# Altium project TIDA-010086_mod.PrjPcb (part 2 of 11)

## Sheet XTIDA-010086_Power Stage.SchDoc: Power Stage
size 558 x 431 mm; Date: Not shown in title block; ApprovedBy: Not shown in title block; CheckedBy: Not shown in title block; Author: Not shown in title block; CompanyName: Not shown in title block; DrawnBy: Jeff Xie; Engineer: Not shown in title block; Organization: Not shown in title block; Address1: Not shown in title block; Address2: Not shown in title block; Address3: Not shown in title block; Address4: Not shown in title block; DocumentNumber: 2; Revision: Use project parameter SCH_Rev; SheetNumber: 4; SheetTotal: 8; PageSetup: Record=PageOptions|CenterHorizontal=True|CenterVertical=True|PrintScale=1.00|XCorrection=1.00|YCorrection=1.00|PrintKind=0|BorderSize=5000000|LeftOffset=0|BottomOffset=0|Orientation=2|PaperLength=1000|PaperWidth=1000|Scale=100|PaperSource=15|PrintQuality=600|MediaType=1|DitherType=10|PaperKind=Letter|PrintScaleMode=1; CurrentTime: Not shown in title block; CurrentDate: Not shown in title block; Time: Not shown in title block; DocumentFullPathAndName: Not shown in title block; DocumentName: Not shown in title block; ModifiedDate: Not shown in title block; ImagePath: Not shown in title block
Used 8 times, as channels MAIN SHEET/Ch1, MAIN SHEET/Ch2, MAIN SHEET/Ch3, MAIN SHEET/Ch4, MAIN SHEET/Ch5, MAIN SHEET/Ch6, MAIN SHEET/Ch7, MAIN SHEET/Ch8. Parts and nets are listed once, with the designators drawn on the sheet.
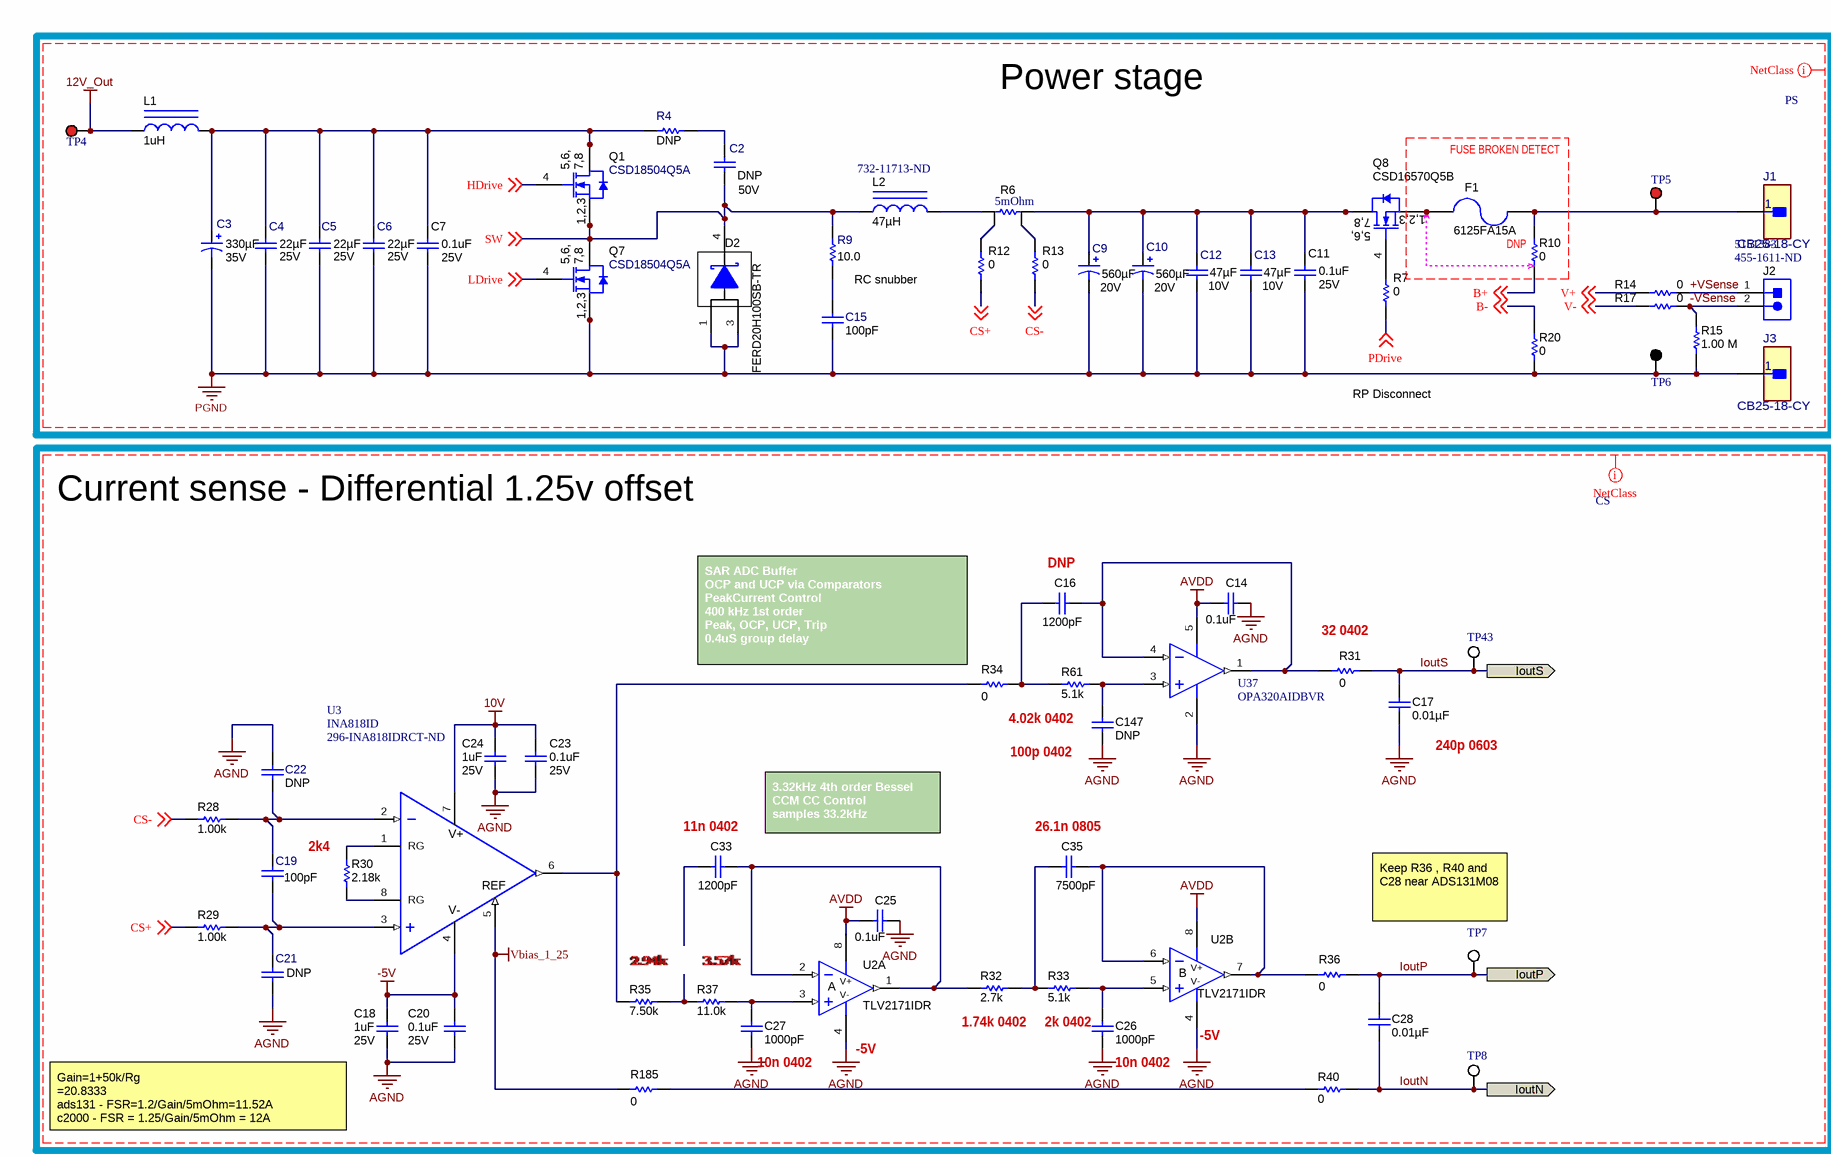
[diagram p5: XTIDA-010086_Power Stage.SchDoc, top left]
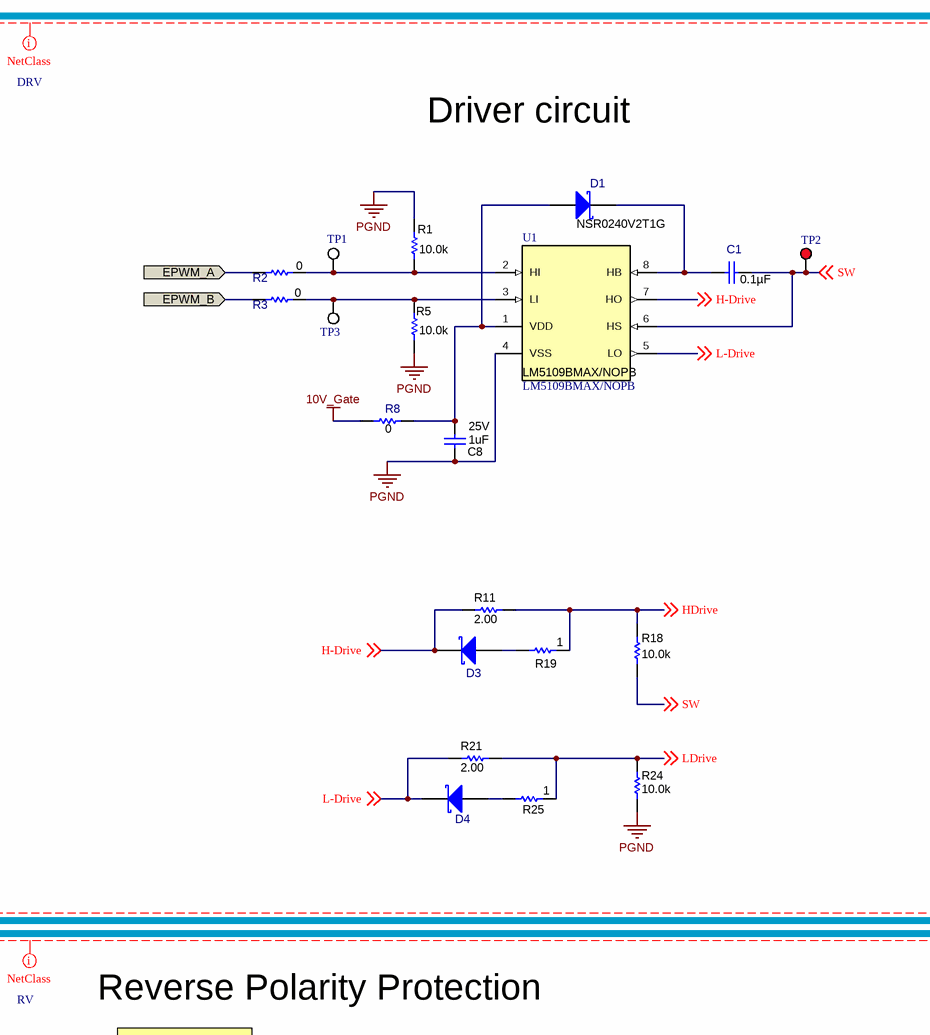
[diagram p6: XTIDA-010086_Power Stage.SchDoc, top right]
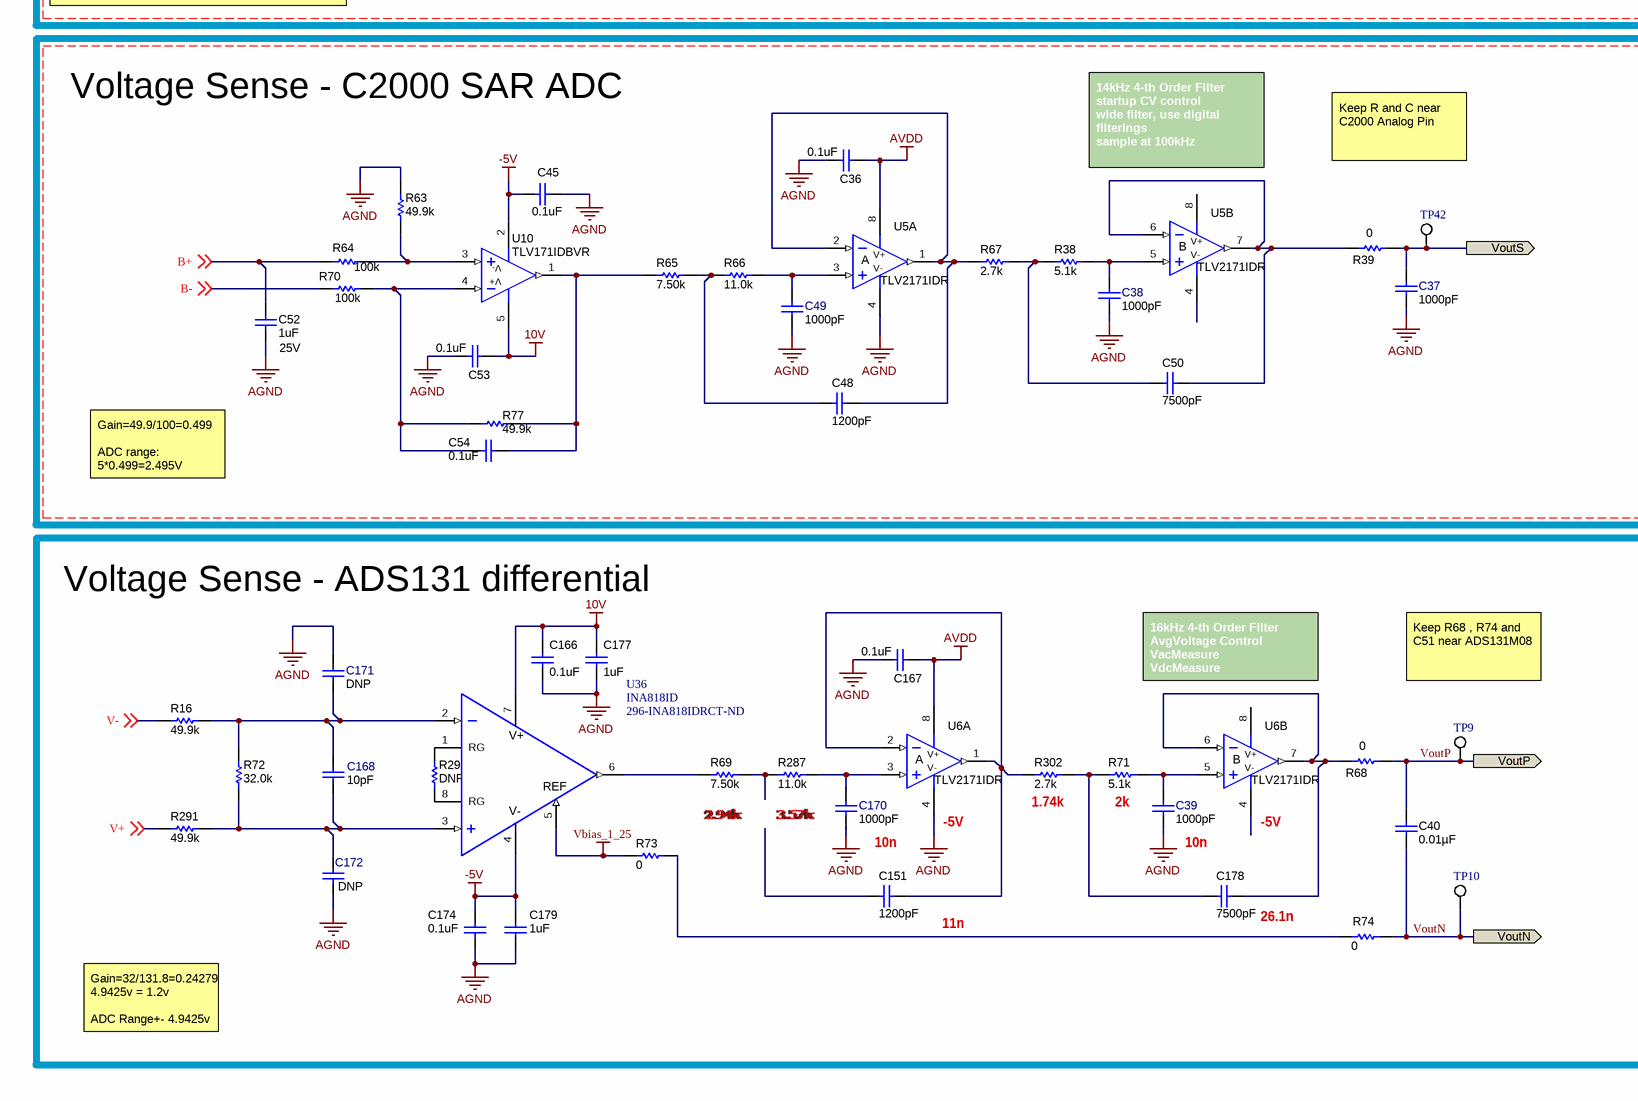
[diagram p7: XTIDA-010086_Power Stage.SchDoc, bottom left]
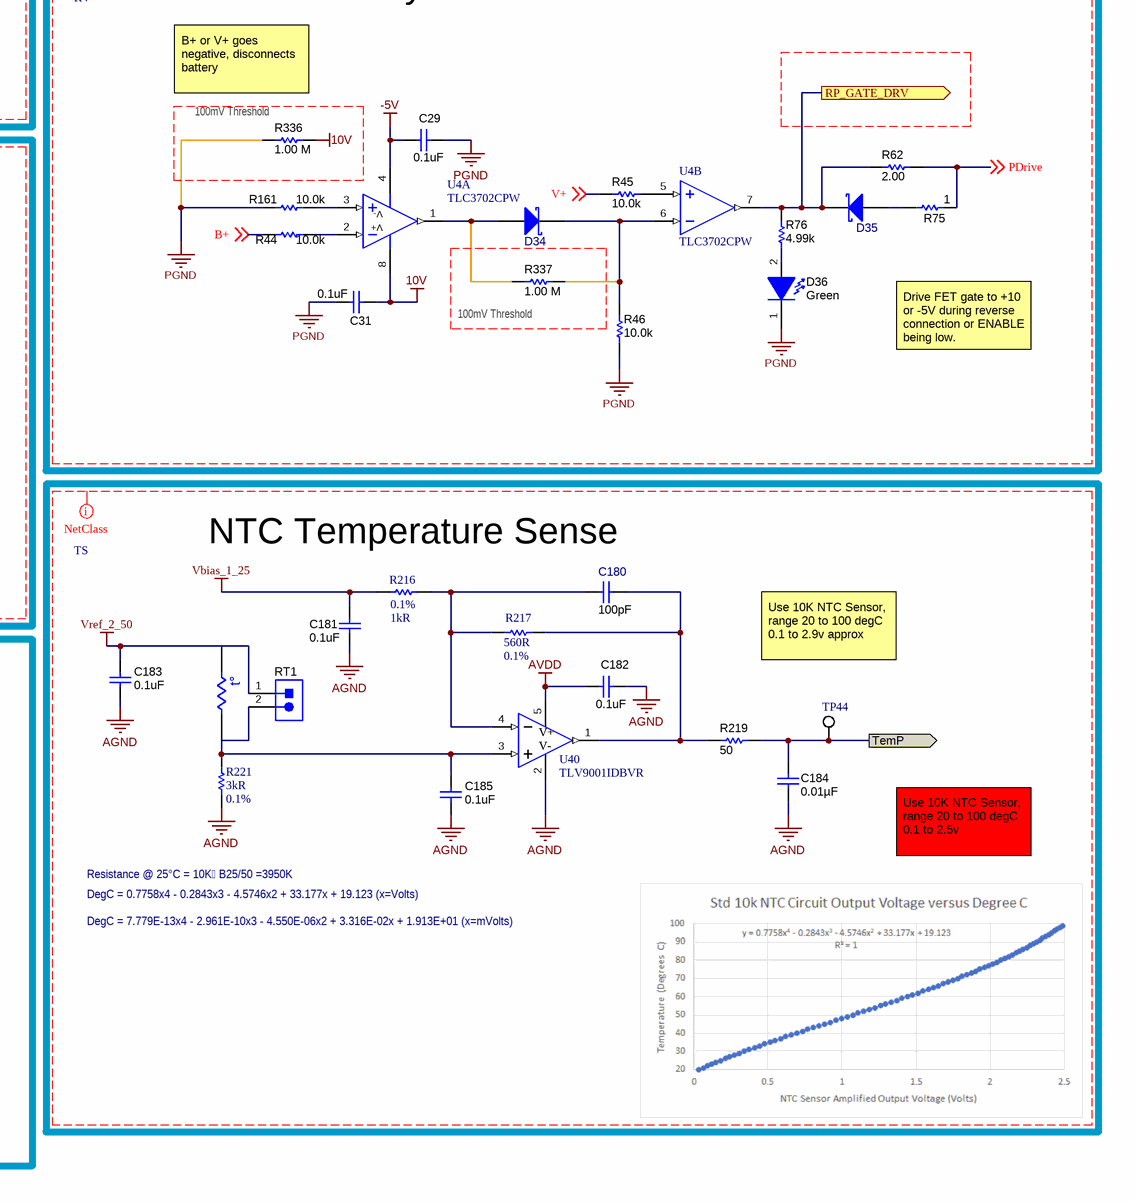
[diagram p8: XTIDA-010086_Power Stage.SchDoc, bottom right]

### Parts
(Parts that share a designator on the sheet are numbered #1, #2 ... from top to bottom, then left to right.)
C1  ValueDisplayed: 0.1µF  [0603L]  (hidden comment: C0603C104J3RACTU)
C2  ValueDisplayed: DNP  Value2: 50V  [0603L]  (hidden comment: GRM1885C1H101JA01D)
C3  ValueDisplayed: 330µF  Value2: 35V  [CAPSMT_62_F12]  (hidden comment: 35SVPK330M)
C4  ValueDisplayed: 22µF  Value2: 25V  [1210_270]  (hidden comment: GRM32ER71E226KE15L)
C5  ValueDisplayed: 22µF  Value2: 25V  [1210_270]  (hidden comment: GRM32ER71E226KE15L)
C6  ValueDisplayed: 22µF  Value2: 25V  [1210_270]  (hidden comment: GRM32ER71E226KE15L)
C7  ValueDisplayed: 0.1uF  Value2: 25V  [0603]  (hidden comment: 06033C104JAT2A)
C8  ValueDisplayed: 1uF  VDC_V: 25V  [0603]  (hidden comment: GRM188R71E105KA12D)
C9  ValueDisplayed: 560µF  Value2: 20V  [SM_RADIAL_10AMM]  (hidden comment: 20SVF560M)
C10  ValueDisplayed: 560µF  Value2: 20V  [SM_RADIAL_10AMM]  (hidden comment: 20SVF560M)
C11  ValueDisplayed: 0.1uF  Value2: 25V  [0603]  (hidden comment: 06033C104JAT2A)
C12  ValueDisplayed: 47µF  Value2: 10V  [1210_270]  (hidden comment: GRM32ER71A476ME15L)
C13  ValueDisplayed: 47µF  Value2: 10V  [1210_270]  (hidden comment: GRM32ER71A476ME15L)
C14  ValueDisplayed: 0.1uF  [0603]  (hidden comment: 06033C104JAT2A)
C15  ValueDisplayed: 100pF  [0603L]  (hidden comment: GRM1885C1H101JA01D)
C16  ValueDisplayed: 1200pF  [0402]  (hidden comment: GRM155R71H122KA01D)
C17  ValueDisplayed: 0.01µF  [0603]  (hidden comment: C0603C103J3GECAUTO)
C18  ValueDisplayed: 1uF  VDC_V: 25V  [0603]  (hidden comment: GRM188R71E105KA12D)
C19  ValueDisplayed: 100pF  [0603L]  (hidden comment: GRM1885C1H101JA01D)
C20  ValueDisplayed: 0.1uF  Value2: 25V  [0603]  (hidden comment: 06033C104JAT2A)
C21  value DNP  [0603L]  (hidden comment: GRM1885C1H101JA01D)
C22  value DNP  [0603L]  (hidden comment: GRM1885C1H101JA01D)
C23  ValueDisplayed: 0.1uF  Value2: 25V  [0603]  (hidden comment: 06033C104JAT2A)
C24  ValueDisplayed: 1uF  Value2: 25V  [0603]  (hidden comment: GRM188R71E105KA12D)
C25  ValueDisplayed: 0.1uF  [0603]  (hidden comment: 06033C104JAT2A)
C26  ValueDisplayed: 1000pF  [0402]  (hidden comment: 885012205044)
C27  ValueDisplayed: 1000pF  [0402]  (hidden comment: 885012205044)
C28  ValueDisplayed: 0.01µF  [0603]  (hidden comment: C0603C103J3GECAUTO)
C29  ValueDisplayed: 0.1uF  [0603]  (hidden comment: 06033C104JAT2A)
C31  ValueDisplayed: 0.1uF  [0603]  (hidden comment: 06033C104JAT2A)
C33  ValueDisplayed: 1200pF  [0402]  (hidden comment: GRM155R71H122KA01D)
C35  ValueDisplayed: 7500pF  [0805_HV]  (hidden comment: GRM2195C1H752JA01D)
C36  ValueDisplayed: 0.1uF  [0603]  (hidden comment: 06033C104JAT2A)
C37  ValueDisplayed: 1000pF  [0603L]  (hidden comment: GRM1885C1H102JA01D)
C38  ValueDisplayed: 1000pF  [0603L]  (hidden comment: GRM1885C1H102JA01D)
C39  ValueDisplayed: 1000pF  [0603L]  (hidden comment: GRM1885C1H102JA01D)
C40  ValueDisplayed: 0.01µF  [0603]  (hidden comment: C0603C103J3GECAUTO)
C45  ValueDisplayed: 0.1uF  [0603]  (hidden comment: 06033C104JAT2A)
C48  ValueDisplayed: 1200pF  [0402]  (hidden comment: GRM155R71H122KA01D)
C49  ValueDisplayed: 1000pF  [0603L]  (hidden comment: GRM1885C1H102JA01D)
C50  ValueDisplayed: 7500pF  [0805_HV]  (hidden comment: GRM2195C1H752JA01D)
C52  ValueDisplayed: 1uF  Value2: 25V  [0603]  (hidden comment: GRM188R71E105KA12D)
C53  ValueDisplayed: 0.1uF  [0603]  (hidden comment: 06033C104JAT2A)
C54  value 0.1uF  [0603]  (hidden comment: 06033C104JAT2A)
C147  ValueDisplayed: DNP  [0402]  (hidden comment: GRM155R71H122KA01D)
C151  ValueDisplayed: 1200pF  [0402]  (hidden comment: GRM155R71H122KA01D)
C166  ValueDisplayed: 0.1uF  [0603]  (hidden comment: 06033C104JAT2A)
C167  ValueDisplayed: 0.1uF  [0603]  (hidden comment: 06033C104JAT2A)
C168  ValueDisplayed: 10pF  [0603L]  (hidden comment: GRM1885C1H100JA01D)
C170  ValueDisplayed: 1000pF  [0603L]  (hidden comment: GRM1885C1H102JA01D)
C171  value DNP  [0603L]  (hidden comment: GRM1885C1H101JA01D)
C172  value DNP  [0603L]  (hidden comment: GRM1885C1H101JA01D)
C174  ValueDisplayed: 0.1uF  [0603]  (hidden comment: 06033C104JAT2A)
C177  ValueDisplayed: 1uF  [0603]  (hidden comment: GRM188R71E105KA12D)
C178  ValueDisplayed: 7500pF  [0805_HV]  (hidden comment: GRM2195C1H752JA01D)
C179  ValueDisplayed: 1uF  [0603]  (hidden comment: GRM188R71E105KA12D)
C180  ValueDisplayed: 100pF  [0603L]  (hidden comment: GRM1885C1H101JA01D)
C181  ValueDisplayed: 0.1uF  [0603]  (hidden comment: 06033C104JAT2A)
C182  ValueDisplayed: 0.1uF  [0603]  (hidden comment: 06033C104JAT2A)
C183  ValueDisplayed: 0.1uF  [0603]  (hidden comment: 06033C104JAT2A)
C184  ValueDisplayed: 0.01µF  [0603]  (hidden comment: C0603C103J3GECAUTO)
C185  ValueDisplayed: 0.1uF  [0603]  (hidden comment: 06033C104JAT2A)
D1  NSR0240V2T1G  [SOD-523]
D2  FERD20H100SB-TR  [DPAK]
D3  NSR0240V2T1G  [SOD-523]  (value not drawn)
D4  NSR0240V2T1G  [SOD-523]  (value not drawn)
D34  NSR0240V2T1G  [SOD-523]  (value not drawn)
D35  NSR0240V2T1G  [SOD-523]  (value not drawn)
D36  value Green  [WL-SMCW_GREEN]  (hidden comment: 150060VS75000)
F1  6125FA15A  [6125FA]
J1  CB25-18-CY  [FP-CB25-18-CY_CONN_TERM_LUG_25MM4_7MM9-MFG]
J2  Supplier Part Number 1: 455-1611-ND  Supplier Part Number 2: 5151383  [JST_B2B-EH-A]  (hidden comment: B2B-EH-A(LF)(SN))
J3  CB25-18-CY  [FP-CB25-18-CY_CONN_TERM_LUG_25MM4_7MM9-MFG]
L1  ValueDisplayed: 1uH  [WE-LHMI_4020]  (hidden comment: 74437324010)
L2  ValueDisplayed: 47µH  Supplier Part Number 1: 732-11713-ND  [WE-HCF Round_2920]  (hidden comment: 74437529203470)
Q1  CSD18504Q5A  [DQJ0008A]
Q7  CSD18504Q5A  [DQJ0008A]
Q8  CSD16570Q5B  [DNK0008A]
R1  ValueDisplayed: 10.0k  [0603]  (hidden comment: RC0603FR-0710KL)
R2  ValueDisplayed: 0  [0603L]  (hidden comment: RC0603JR-070RL)
R3  ValueDisplayed: 0  [0603L]  (hidden comment: RC0603JR-070RL)
R4  ValueDisplayed: DNP  [1206L]  (hidden comment: RC1206FR-0710RL)
R5  ValueDisplayed: 10.0k  [0603]  (hidden comment: RC0603FR-0710KL)
R6  ValueDisplayed: 5mOhm  [CSM3637Z]  (hidden comment: Y14880R00500B9R)
R7  ValueDisplayed: 0  [0402]  (hidden comment: CRCW04020000Z0ED)
R8  ValueDisplayed: 0  [0603L]  (hidden comment: RC0603JR-070RL)
R9  ValueDisplayed: 10.0  [1206L]  (hidden comment: RC1206FR-0710RL)
R10  ValueDisplayed: 0  [0402]  (hidden comment: CRCW04020000Z0ED)
R11  ValueDisplayed: 2.00  [0603]  (hidden comment: CRCW06032R00FKEA)
R12  ValueDisplayed: 0  [0402]  (hidden comment: CRCW04020000Z0ED)
R13  ValueDisplayed: 0  [0402]  (hidden comment: CRCW04020000Z0ED)
R14  ValueDisplayed: 0  [0402]  (hidden comment: CRCW04020000Z0ED)
R15  ValueDisplayed: 1.00 M  [0603]  (hidden comment: CRCW06031M00FKEA)
R16  ValueDisplayed: 49.9k  [0603]  (hidden comment: CRCW060349K9FKEA)
R17  ValueDisplayed: 0  [0402]  (hidden comment: CRCW04020000Z0ED)
R18  ValueDisplayed: 10.0k  [0603]  (hidden comment: RC0603FR-0710KL)
R19  ValueDisplayed: 1  [0603]  (hidden comment: RC0603FR-071RL)
R20  ValueDisplayed: 0  [0402]  (hidden comment: CRCW04020000Z0ED)
R21  ValueDisplayed: 2.00  [0603]  (hidden comment: CRCW06032R00FKEA)
R24  ValueDisplayed: 10.0k  [0603]  (hidden comment: RC0603FR-0710KL)
R25  ValueDisplayed: 1  [0603]  (hidden comment: RC0603FR-071RL)
R28  ValueDisplayed: 1.00k  [0603]  (hidden comment: RG1608P-102-B-T5)
R29  ValueDisplayed: 1.00k  [0603]  (hidden comment: RG1608P-102-B-T5)
R30  ValueDisplayed: 2.18k  [0603]  (hidden comment: RT0603BRD072K18L)
R31  ValueDisplayed: 0  [0402]  (hidden comment: CRCW04020000Z0ED)
R32  ValueDisplayed: 2.7k  [0402]  (hidden comment: CRCW04022K70JNED)
R33  ValueDisplayed: 5.1k  [0402]  (hidden comment: CRCW04025K10JNED)
R34  ValueDisplayed: 0  [0402]  (hidden comment: CRCW04020000Z0ED)
R35  ValueDisplayed: 7.50k  [0402]  (hidden comment: CRCW04027K50FKED)
R36  ValueDisplayed: 0  [0402]  (hidden comment: CRCW04020000Z0ED)
R37  ValueDisplayed: 11.0k  [0402]  (hidden comment: CRCW040211K0FKED)
R38  ValueDisplayed: 5.1k  [0402]  (hidden comment: CRCW04025K10JNED)
R39  ValueDisplayed: 0  [0402]  (hidden comment: CRCW04020000Z0ED)
R40  ValueDisplayed: 0  [0402]  (hidden comment: CRCW04020000Z0ED)
R44  ValueDisplayed: 10.0k  [0603]  (hidden comment: RC0603FR-0710KL)
R45  ValueDisplayed: 10.0k  [0603]  (hidden comment: RC0603FR-0710KL)
R46  ValueDisplayed: 10.0k  [0603]  (hidden comment: RC0603FR-0710KL)
R61  ValueDisplayed: 5.1k  [0402]  (hidden comment: CRCW04025K10JNED)
R62  ValueDisplayed: 2.00  [0603]  (hidden comment: CRCW06032R00FKEA)
R63  ValueDisplayed: 49.9k  [0603]  (hidden comment: CRCW060349K9FKEA)
R64  ValueDisplayed: 100k  [0603]  (hidden comment: RT0603BRD07100KL)
R65  ValueDisplayed: 7.50k  [0402]  (hidden comment: CRCW04027K50FKED)
R66  ValueDisplayed: 11.0k  [0402]  (hidden comment: CRCW040211K0FKED)
R67  ValueDisplayed: 2.7k  [0402]  (hidden comment: CRCW04022K70JNED)
R68  ValueDisplayed: 0  [0402]  (hidden comment: CRCW04020000Z0ED)
R69  ValueDisplayed: 7.50k  [0402]  (hidden comment: CRCW04027K50FKED)
R70  ValueDisplayed: 100k  [0603]  (hidden comment: RT0603BRD07100KL)
R71  ValueDisplayed: 5.1k  [0402]  (hidden comment: CRCW04025K10JNED)
R72  ValueDisplayed: 32.0k  [0603]  (hidden comment: RN731JTTD3202B25)
R73  ValueDisplayed: 0  [0402]  (hidden comment: CRCW04020000Z0ED)
R74  ValueDisplayed: 0  [0402]  (hidden comment: CRCW04020000Z0ED)
R75  ValueDisplayed: 1  [0603]  (hidden comment: RC0603FR-071RL)
R76  ValueDisplayed: 4.99k  [0603L]  (hidden comment: CRCW06034K99FKEA)
R77  ValueDisplayed: 49.9k  [0603]  (hidden comment: CRCW060349K9FKEA)
R161  ValueDisplayed: 10.0k  [0603]  (hidden comment: RC0603FR-0710KL)
R185  ValueDisplayed: 0  [0402]  (hidden comment: CRCW04020000Z0ED)
R216  Tolerance: 0.1%  Resistance: 1kR  [RESC1608X55X25ML10T15]  (hidden comment: RT0603BRE071KL)
R217  Resistance: 560R  Tolerance: 0.1%  [RESC1608X55X25LL10T15]  (hidden comment: RT0603BRD07560RL)
R219  ValueDisplayed: 50  [0402]  (hidden comment: FC0402E50R0BST1)
R221  Resistance: 3kR  Tolerance: 0.1%  [RESC1608X55X30NL20T20]  (hidden comment: ERA-3YEB302V)
R287  ValueDisplayed: 11.0k  [0402]  (hidden comment: CRCW040211K0FKED)
R290  ValueDisplayed: DNP  [0402]  (hidden comment: CRCW04020000Z0ED)
R291  ValueDisplayed: 49.9k  [0603]  (hidden comment: CRCW060349K9FKEA)
R302  ValueDisplayed: 2.7k  [0402]  (hidden comment: CRCW04022K70JNED)
R336  ValueDisplayed: 1.00 M  [0603]  (hidden comment: CRCW06031M00FKEA)
R337  ValueDisplayed: 1.00 M  [0603]  (hidden comment: CRCW06031M00FKEA)
RT1#1  B2B-EH-A(LF)(SN)  [JST_B2B-EH-A]  (value not drawn)
RT1#2  Res Thermal  [JST_B2B-EH-A]  (value not drawn)  (graphical)
TP1  5002  [Keystone5002]  (value not drawn)
TP2  5000  [Keystone5000]  (value not drawn)
TP3  5002  [Keystone5002]  (value not drawn)
TP4  5000  [Keystone5000]  (value not drawn)
TP5  5000  [Keystone5000]  (value not drawn)
TP6  5001  [Keystone5001]  (value not drawn)
TP7  5002  [Keystone5002]  (value not drawn)
TP8  5002  [Keystone5002]  (value not drawn)
TP9  5002  [Keystone5002]  (value not drawn)
TP10  5002  [Keystone5002]  (value not drawn)
TP42  5002  [Keystone5002]  (value not drawn)
TP43  5002  [Keystone5002]  (value not drawn)
TP44  5002  [Keystone5002]  (value not drawn)
U1  LM5109BMAX/NOPB  [D0008A_N]
U2  TLV2171IDR  [D0008A_N]  (parts A,B of 2)
U3  INA818ID  Supplier Part Number 1: 296-INA818IDRCT-ND  [SOIC-8_TEX]
U4  TLC3702CPW  [PW8-L]  (parts A,B of 2)
U5  TLV2171IDR  [D0008A_N]  (parts A,B of 2)
U6  TLV2171IDR  [D0008A_N]  (parts A,B of 2)
U10  TLV171IDBVR  [DBV0005A_N]
U36  INA818ID  Supplier Part Number 1: 296-INA818IDRCT-ND  [SOIC-8_TEX]
U37  OPA320AIDBVR  [DBV0005A_L]
U40  TLV9001IDBVR  [DBV0005A_L]

### Blocks framed on the sheet
Power stage: C2-C7 C9-C13 C15 D2 F1 J1-J3 L1 L2 Q1 Q7 Q8 R4 R6 R7 R9 R10 R12-R15 R17 R20 TP4-TP6
Driver circuit: C1 C8 D1 D3 D4 R1-R3 R5 R8 R11 R18 R19 R21 R24 R25 TP1-TP3 U1
Current sense - Differential 1.25v offset: C14 C16-C28 C33 C35 C147 R28-R37 R40 R61 R185 TP7 TP8 TP43 U2 U3 U37
Reverse Polarity Protection: C29 C31 D34-D36 R44-R46 R62 R75 R76 R161 R336 R337 U4
Voltage Sense - C2000 SAR ADC: C36-C38 C45 C48-C50 C52-C54 R38 R39 R63-R67 R70 R77 TP42 U5 U10
NTC Temperature Sense: C180-C185 R216 R217 R219 R221 RT1#1 RT1#2 TP44 U40
Voltage Sense - ADS131 differential: C39 C40 C151 C166-C168 C170-C172 C174 C177-C179 R16 R68 R69 R71-R74 R287 R290 R291 R302 TP9 TP10 U6 U36

### Ports
EPWM_A (in), EPWM_B (in), IoutN (out), IoutP (out), IoutS (out), RP_GATE_DRV (out), TemP (out), VoutN (out), VoutP (out), VoutS (out)

### Nets
10V: C23.1 C24.1 C31.1 C53.1 C166.1 C177.1 R336.2 U3.7(V+) U4.8(VDD) U10.5(V+) U36.7(V+)
10V_Gate: R8.2
12V_Out: L1.1 TP4.1
-5V: C18.1 C20.1 C29.1 C45.1 C174.1 C179.1 U3.4(V-) U4.4(GND) U10.2(V-) U36.4(V-)
AGND: C14.2 C17.2 C18.2 C20.2 C21.1 C22.2 C23.2 C24.2 C25.2 C26.2 C27.2 C36.2 C37.1 C38.1 C39.1 C45.2 C49.1 C52.2 C53.2 C147.2 C166.2 C167.2 C170.1 C171.2 C172.2 C174.2 C177.2 C179.2 C181.1 C182.2 C183.1 C184.2 C185.1 R63.2 R221.1 U2.4(V-) U5.4(V-) U6.4(V-) U37.2(V-) U40.2(V-)
AVDD: C14.1 C25.1 C36.1 C167.1 C182.1 U2.8(V+) U5.8(V+) U6.8(V+) U37.5(V+) U40.5(V+)
PGND: C3.2(-) C4.2 C5.2 C6.2 C7.2 C8.1 C9.2(-) C10.2(-) C11.2 C12.2 C13.2 C15.1 C29.2 C31.2 D2.1(A) D2.3(A) D36.1(K) J3.1 Q7.1(S) Q7.2(S) Q7.3(S) R1.2 R5.1 R15.2 R20.1 R24.1 R46.2 R161.2 R336.1 TP6.1 U1.4(VSS)
Vbias_1_25: C181.2 R73.2 R185.2 R216.1 U3.5(REF) U36.5(REF)
Vref_2_50: C183.2 RT1#1.1 RT1#2.1
+VSense: J2.1 R14.2
-VSense: J2.2 R15.1 R17.2
B+: C52.1 R10.1 R44.2 R64.1 ; off-sheet B+
B-: R20.2 R70.1 ; off-sheet B-
CS+: R12.1 R29.1 ; off-sheet CS+
CS-: R13.1 R28.1 ; off-sheet CS-
EPWM_A: R2.2 ; port EPWM_A
EPWM_B: R3.2 ; port EPWM_B
H-Drive: D3.1(K) R11.2 U1.7(HO) ; off-sheet H-Drive
HDrive: Q1.4(G) R11.1 R18.2 R19.2 ; off-sheet HDrive
IoutN: C28.2 R40.1 TP8.1 ; port IoutN
IoutP: C28.1 R36.2 TP7.1 ; port IoutP
IoutS: C17.1 R31.2 TP43.1 ; port IoutS
L-Drive: D4.1(K) R21.2 U1.5(LO) ; off-sheet L-Drive
LDrive: Q7.4(G) R21.1 R24.2 R25.2 ; off-sheet LDrive
PDrive: R7.1 R62.1 R75.2 ; off-sheet PDrive
RP_GATE_DRV: D35.1(K) R62.2 R76.1 U4.7(2OUT) ; port RP_GATE_DRV
SW: C1.2 C2.1 D2.4(K) L2.1 Q1.1(S) Q1.2(S) Q1.3(S) Q7.5(D) Q7.6(D) Q7.7(D) Q7.8(D) Q7.9(D) R9.1 R18.1 TP2.1 U1.6(HS) ; off-sheet SW
TemP: C184.1 R219.2 TP44.1 ; port TemP
V+: R14.1 R45.2 R291.2 ; off-sheet V+
V-: R16.2 R17.1 ; off-sheet V-
VoutN: C40.2 R74.1 TP10.1 ; port VoutN
VoutP: C40.1 R68.2 TP9.1 ; port VoutP
VoutS: C37.2 R39.2 TP42.1 ; port VoutS
NetC1_1: C1.1 D1.1(K) U1.8(HB)
NetC2_2: C2.2 R4.2
NetC3_1: C3.1(+) C4.1 C5.1 C6.1 C7.1 L1.2 Q1.5(D) Q1.6(D) Q1.7(D) Q1.8(D) Q1.9(D) R4.1
NetC8_2: C8.2 D1.2(A) R8.1 U1.1(VDD)
NetC9_1: C9.1(+) C10.1(+) C11.1 C12.1 C13.1 Q8.5(D) Q8.6(D) Q8.7(D) Q8.8(D) Q8.9(D) R6.1
NetC15_2: C15.2 R9.2
NetC16_1: C16.1 R31.1 U37.1(OUT) U37.4(IN-)
NetC16_2: C16.2 R34.2 R61.1
NetC19_1: C19.1 C22.1 R28.2 U3.2(IN-)
NetC19_2: C19.2 C21.2 R29.2 U3.3(IN+)
NetC26_1: C26.1 R33.2 U2.5(IN+)
NetC27_1: C27.1 R37.2 U2.3(IN+)
NetC33_1: C33.1 R32.1 U2.1(OUT) U2.2(IN-)
NetC33_2: C33.2 R35.2 R37.1
NetC35_1: C35.1 R36.1 U2.6(IN-) U2.7(OUT)
NetC35_2: C35.2 R32.2 R33.1
NetC38_2: C38.2 R38.2 U5.5(IN+)
NetC39_2: C39.2 R71.2 U6.5(IN+)
NetC48_1: C48.1 R67.1 U5.1(OUT) U5.2(IN-)
NetC48_2: C48.2 R65.2 R66.1
NetC49_2: C49.2 R66.2 U5.3(IN+)
NetC50_1: C50.1 R39.1 U5.6(IN-) U5.7(OUT)
NetC50_2: C50.2 R38.1 R67.2
NetC54_1: C54.1 R70.2 R77.1 U10.4(IN-)
NetC54_2: C54.2 R65.1 R77.2 U10.1(OUT)
NetC147_1: C147.1 R61.2 U37.3(IN+)
NetC151_1: C151.1 R302.1 U6.1(OUT) U6.2(IN-)
NetC151_2: C151.2 R69.2 R287.1
NetC168_1: C168.1 C171.1 R16.1 R72.2 U36.2(IN-)
NetC168_2: C168.2 C172.1 R72.1 R291.1 U36.3(IN+)
NetC170_2: C170.2 R287.2 U6.3(IN+)
NetC178_1: C178.1 R68.1 U6.6(IN-) U6.7(OUT)
NetC178_2: C178.2 R71.1 R302.2
NetC180_1: C180.1 R216.2 R217.1 U40.4(IN-)
NetC180_2: C180.2 R217.2 R219.1 U40.1(OUT)
NetC185_2: C185.2 R221.2 RT1#1.2 RT1#2.2 U40.3(IN+)
NetD3_2: D3.2(A) R19.1
NetD4_2: D4.2(A) R25.1
NetD34_1: D34.1(K) R46.1 R337.2 U4.6(2IN-)
NetD34_2: D34.2(A) R337.1 U4.1(1OUT)
NetD35_2: D35.2(A) R75.1
NetD36_2: D36.2(A) R76.2
NetF1_1: F1.1 J1.1 R10.2 TP5.1
NetF1_2: F1.2 Q8.1(S) Q8.2(S) Q8.3(S)
NetL2_2: L2.2 R6.2
NetQ8_4: Q8.4(G) R7.2
NetR1_1: R1.1 R2.1 TP1.1 U1.2(HI)
NetR3_1: R3.1 R5.2 TP3.1 U1.3(LI)
NetR6_3: R6.3 R13.2
NetR6_4: R6.4 R12.2
NetR30_1: R30.1 U3.8(RG)
NetR30_2: R30.2 U3.1(RG)
NetR34_1: R34.1 R35.1 U3.6(OUT)
NetR40_2: R40.2 R185.1
NetR44_1: R44.1 U4.2(1IN-)
NetR45_1: R45.1 U4.5(2IN+)
NetR63_1: R63.1 R64.2 U10.3(IN+)
NetR69_1: R69.1 U36.6(OUT)
NetR73_1: R73.1 R74.2
NetR161_1: R161.1 U4.3(1IN+)
NetR290_1: R290.1 U36.1(RG)
NetR290_2: R290.2 U36.8(RG)

### Channels
MAIN SHEET/Ch1: designators C1=C1_Ch1 C2=C2_Ch1 C3=C3_Ch1 C4=C4_Ch1 C5=C5_Ch1 C6=C6_Ch1 C7=C7_Ch1 C8=C8_Ch1 C9=C9_Ch1 C10=C10_Ch1 C11=C11_Ch1 C12=C12_Ch1 C13=C13_Ch1 C14=C14_Ch1 C15=C15_Ch1 C16=C16_Ch1 C17=C17_Ch1 C18=C18_Ch1 C19=C19_Ch1 C20=C20_Ch1 C21=C21_Ch1 C22=C22_Ch1 C23=C23_Ch1 C24=C24_Ch1 C25=C25_Ch1 C26=C26_Ch1 C27=C27_Ch1 C28=C28_Ch1 C29=C29_Ch1 C31=C31_Ch1 C33=C33_Ch1 C35=C35_Ch1 C36=C36_Ch1 C37=C37_Ch1 C38=C38_Ch1 C39=C39_Ch1 C40=C40_Ch1 C45=C45_Ch1 C48=C48_Ch1 C49=C49_Ch1 C50=C50_Ch1 C52=C52_Ch1 C53=C53_Ch1 C54=C54_Ch1 C147=C147_Ch1 C151=C151_Ch1 C166=C166_Ch1 C167=C167_Ch1 C168=C168_Ch1 C170=C170_Ch1 C171=C171_Ch1 C172=C172_Ch1 C174=C174_Ch1 C177=C177_Ch1 C178=C178_Ch1 C179=C179_Ch1 C180=C180_Ch1 C181=C181_Ch1 C182=C182_Ch1 C183=C183_Ch1 C184=C184_Ch1 C185=C185_Ch1 D1=D1_Ch1 D2=D2_Ch1 D3=D3_Ch1 D4=D4_Ch1 D34=D34_Ch1 D35=D35_Ch1 D36=D36_Ch1 F1=F1_Ch1 J1=J1_Ch1 J2=J2_Ch1 J3=J3_Ch1 L1=L1_Ch1 L2=L2_Ch1 Q1=Q1_Ch1 Q7=Q7_Ch1 Q8=Q8_Ch1 R1=R1_Ch1 R2=R2_Ch1 R3=R3_Ch1 R4=R4_Ch1 R5=R5_Ch1 R6=R6_Ch1 R7=R7_Ch1 R8=R8_Ch1 R9=R9_Ch1 R10=R10_Ch1 R11=R11_Ch1 R12=R12_Ch1 R13=R13_Ch1 R14=R14_Ch1 R15=R15_Ch1 R16=R16_Ch1 R17=R17_Ch1 R18=R18_Ch1 R19=R19_Ch1 R20=R20_Ch1 R21=R21_Ch1 R24=R24_Ch1 R25=R25_Ch1 R28=R28_Ch1 R29=R29_Ch1 R30=R30_Ch1 R31=R31_Ch1 R32=R32_Ch1 R33=R33_Ch1 R34=R34_Ch1 R35=R35_Ch1 R36=R36_Ch1 R37=R37_Ch1 R38=R38_Ch1 R39=R39_Ch1 R40=R40_Ch1 R44=R44_Ch1 R45=R45_Ch1 R46=R46_Ch1 R61=R61_Ch1 R62=R62_Ch1 R63=R63_Ch1 R64=R64_Ch1 R65=R65_Ch1 R66=R66_Ch1 R67=R67_Ch1 R68=R68_Ch1 R69=R69_Ch1 R70=R70_Ch1 R71=R71_Ch1 R72=R72_Ch1 R73=R73_Ch1 R74=R74_Ch1 R75=R75_Ch1 R76=R76_Ch1 R77=R77_Ch1 R161=R161_Ch1 R185=R185_Ch1 R216=R216_Ch1 R217=R217_Ch1 R219=R219_Ch1 R221=R221_Ch1 R287=R287_Ch1 R290=R290_Ch1 R291=R291_Ch1 R302=R302_Ch1 R336=R336_Ch1 R337=R337_Ch1 RT1=RT1_Ch1#2 RT1=RT1_Ch1#1 TP1=TP1_Ch1 TP2=TP2_Ch1 TP3=TP3_Ch1 TP4=TP4_Ch1 TP5=TP5_Ch1 TP6=TP6_Ch1 TP7=TP7_Ch1 TP8=TP8_Ch1 TP9=TP9_Ch1 TP10=TP10_Ch1 TP42=TP42_Ch1 TP43=TP43_Ch1 TP44=TP44_Ch1 U1=U1_Ch1 U2=U2_Ch1 U3=U3_Ch1 U4=U4_Ch1 U5=U5_Ch1 U6=U6_Ch1 U10=U10_Ch1 U36=U36_Ch1 U37=U37_Ch1 U40=U40_Ch1; ports EPWM_A=EPWM_A EPWM_B=EPWM_B IoutN=IoutN IoutP=IoutP IoutS=IoutS RP_GATE_DRV=RP_GATE_DRV TemP=TemP VoutN=VoutN VoutP=VoutP VoutS=VoutS
MAIN SHEET/Ch2: designators C1=C1_Ch2 C2=C2_Ch2 C3=C3_Ch2 C4=C4_Ch2 C5=C5_Ch2 C6=C6_Ch2 C7=C7_Ch2 C8=C8_Ch2 C9=C9_Ch2 C10=C10_Ch2 C11=C11_Ch2 C12=C12_Ch2 C13=C13_Ch2 C14=C14_Ch2 C15=C15_Ch2 C16=C16_Ch2 C17=C17_Ch2 C18=C18_Ch2 C19=C19_Ch2 C20=C20_Ch2 C21=C21_Ch2 C22=C22_Ch2 C23=C23_Ch2 C24=C24_Ch2 C25=C25_Ch2 C26=C26_Ch2 C27=C27_Ch2 C28=C28_Ch2 C29=C29_Ch2 C31=C31_Ch2 C33=C33_Ch2 C35=C35_Ch2 C36=C36_Ch2 C37=C37_Ch2 C38=C38_Ch2 C39=C39_Ch2 C40=C40_Ch2 C45=C45_Ch2 C48=C48_Ch2 C49=C49_Ch2 C50=C50_Ch2 C52=C52_Ch2 C53=C53_Ch2 C54=C54_Ch2 C147=C147_Ch2 C151=C151_Ch2 C166=C166_Ch2 C167=C167_Ch2 C168=C168_Ch2 C170=C170_Ch2 C171=C171_Ch2 C172=C172_Ch2 C174=C174_Ch2 C177=C177_Ch2 C178=C178_Ch2 C179=C179_Ch2 C180=C180_Ch2 C181=C181_Ch2 C182=C182_Ch2 C183=C183_Ch2 C184=C184_Ch2 C185=C185_Ch2 D1=D1_Ch2 D2=D2_Ch2 D3=D3_Ch2 D4=D4_Ch2 D34=D34_Ch2 D35=D35_Ch2 D36=D36_Ch2 F1=F1_Ch2 J1=J1_Ch2 J2=J2_Ch2 J3=J3_Ch2 L1=L1_Ch2 L2=L2_Ch2 Q1=Q1_Ch2 Q7=Q7_Ch2 Q8=Q8_Ch2 R1=R1_Ch2 R2=R2_Ch2 R3=R3_Ch2 R4=R4_Ch2 R5=R5_Ch2 R6=R6_Ch2 R7=R7_Ch2 R8=R8_Ch2 R9=R9_Ch2 R10=R10_Ch2 R11=R11_Ch2 R12=R12_Ch2 R13=R13_Ch2 R14=R14_Ch2 R15=R15_Ch2 R16=R16_Ch2 R17=R17_Ch2 R18=R18_Ch2 R19=R19_Ch2 R20=R20_Ch2 R21=R21_Ch2 R24=R24_Ch2 R25=R25_Ch2 R28=R28_Ch2 R29=R29_Ch2 R30=R30_Ch2 R31=R31_Ch2 R32=R32_Ch2 R33=R33_Ch2 R34=R34_Ch2 R35=R35_Ch2 R36=R36_Ch2 R37=R37_Ch2 R38=R38_Ch2 R39=R39_Ch2 R40=R40_Ch2 R44=R44_Ch2 R45=R45_Ch2 R46=R46_Ch2 R61=R61_Ch2 R62=R62_Ch2 R63=R63_Ch2 R64=R64_Ch2 R65=R65_Ch2 R66=R66_Ch2 R67=R67_Ch2 R68=R68_Ch2 R69=R69_Ch2 R70=R70_Ch2 R71=R71_Ch2 R72=R72_Ch2 R73=R73_Ch2 R74=R74_Ch2 R75=R75_Ch2 R76=R76_Ch2 R77=R77_Ch2 R161=R161_Ch2 R185=R185_Ch2 R216=R216_Ch2 R217=R217_Ch2 R219=R219_Ch2 R221=R221_Ch2 R287=R287_Ch2 R290=R290_Ch2 R291=R291_Ch2 R302=R302_Ch2 R336=R336_Ch2 R337=R337_Ch2 RT1=RT1_Ch2#2 RT1=RT1_Ch2#1 TP1=TP1_Ch2 TP2=TP2_Ch2 TP3=TP3_Ch2 TP4=TP4_Ch2 TP5=TP5_Ch2 TP6=TP6_Ch2 TP7=TP7_Ch2 TP8=TP8_Ch2 TP9=TP9_Ch2 TP10=TP10_Ch2 TP42=TP42_Ch2 TP43=TP43_Ch2 TP44=TP44_Ch2 U1=U1_Ch2 U2=U2_Ch2 U3=U3_Ch2 U4=U4_Ch2 U5=U5_Ch2 U6=U6_Ch2 U10=U10_Ch2 U36=U36_Ch2 U37=U37_Ch2 U40=U40_Ch2; ports EPWM_A=EPWM_A EPWM_B=EPWM_B IoutN=IoutN IoutP=IoutP IoutS=IoutS RP_GATE_DRV=RP_GATE_DRV TemP=TemP VoutN=VoutN VoutP=VoutP VoutS=VoutS
MAIN SHEET/Ch3: designators C1=C1_Ch3 C2=C2_Ch3 C3=C3_Ch3 C4=C4_Ch3 C5=C5_Ch3 C6=C6_Ch3 C7=C7_Ch3 C8=C8_Ch3 C9=C9_Ch3 C10=C10_Ch3 C11=C11_Ch3 C12=C12_Ch3 C13=C13_Ch3 C14=C14_Ch3 C15=C15_Ch3 C16=C16_Ch3 C17=C17_Ch3 C18=C18_Ch3 C19=C19_Ch3 C20=C20_Ch3 C21=C21_Ch3 C22=C22_Ch3 C23=C23_Ch3 C24=C24_Ch3 C25=C25_Ch3 C26=C26_Ch3 C27=C27_Ch3 C28=C28_Ch3 C29=C29_Ch3 C31=C31_Ch3 C33=C33_Ch3 C35=C35_Ch3 C36=C36_Ch3 C37=C37_Ch3 C38=C38_Ch3 C39=C39_Ch3 C40=C40_Ch3 C45=C45_Ch3 C48=C48_Ch3 C49=C49_Ch3 C50=C50_Ch3 C52=C52_Ch3 C53=C53_Ch3 C54=C54_Ch3 C147=C147_Ch3 C151=C151_Ch3 C166=C166_Ch3 C167=C167_Ch3 C168=C168_Ch3 C170=C170_Ch3 C171=C171_Ch3 C172=C172_Ch3 C174=C174_Ch3 C177=C177_Ch3 C178=C178_Ch3 C179=C179_Ch3 C180=C180_Ch3 C181=C181_Ch3 C182=C182_Ch3 C183=C183_Ch3 C184=C184_Ch3 C185=C185_Ch3 D1=D1_Ch3 D2=D2_Ch3 D3=D3_Ch3 D4=D4_Ch3 D34=D34_Ch3 D35=D35_Ch3 D36=D36_Ch3 F1=F1_Ch3 J1=J1_Ch3 J2=J2_Ch3 J3=J3_Ch3 L1=L1_Ch3 L2=L2_Ch3 Q1=Q1_Ch3 Q7=Q7_Ch3 Q8=Q8_Ch3 R1=R1_Ch3 R2=R2_Ch3 R3=R3_Ch3 R4=R4_Ch3 R5=R5_Ch3 R6=R6_Ch3 R7=R7_Ch3 R8=R8_Ch3 R9=R9_Ch3 R10=R10_Ch3 R11=R11_Ch3 R12=R12_Ch3 R13=R13_Ch3 R14=R14_Ch3 R15=R15_Ch3 R16=R16_Ch3 R17=R17_Ch3 R18=R18_Ch3 R19=R19_Ch3 R20=R20_Ch3 R21=R21_Ch3 R24=R24_Ch3 R25=R25_Ch3 R28=R28_Ch3 R29=R29_Ch3 R30=R30_Ch3 R31=R31_Ch3 R32=R32_Ch3 R33=R33_Ch3 R34=R34_Ch3 R35=R35_Ch3 R36=R36_Ch3 R37=R37_Ch3 R38=R38_Ch3 R39=R39_Ch3 R40=R40_Ch3 R44=R44_Ch3 R45=R45_Ch3 R46=R46_Ch3 R61=R61_Ch3 R62=R62_Ch3 R63=R63_Ch3 R64=R64_Ch3 R65=R65_Ch3 R66=R66_Ch3 R67=R67_Ch3 R68=R68_Ch3 R69=R69_Ch3 R70=R70_Ch3 R71=R71_Ch3 R72=R72_Ch3 R73=R73_Ch3 R74=R74_Ch3 R75=R75_Ch3 R76=R76_Ch3 R77=R77_Ch3 R161=R161_Ch3 R185=R185_Ch3 R216=R216_Ch3 R217=R217_Ch3 R219=R219_Ch3 R221=R221_Ch3 R287=R287_Ch3 R290=R290_Ch3 R291=R291_Ch3 R302=R302_Ch3 R336=R336_Ch3 R337=R337_Ch3 RT1=RT1_Ch3#2 RT1=RT1_Ch3#1 TP1=TP1_Ch3 TP2=TP2_Ch3 TP3=TP3_Ch3 TP4=TP4_Ch3 TP5=TP5_Ch3 TP6=TP6_Ch3 TP7=TP7_Ch3 TP8=TP8_Ch3 TP9=TP9_Ch3 TP10=TP10_Ch3 TP42=TP42_Ch3 TP43=TP43_Ch3 TP44=TP44_Ch3 U1=U1_Ch3 U2=U2_Ch3 U3=U3_Ch3 U4=U4_Ch3 U5=U5_Ch3 U6=U6_Ch3 U10=U10_Ch3 U36=U36_Ch3 U37=U37_Ch3 U40=U40_Ch3; ports EPWM_A=EPWM_A EPWM_B=EPWM_B IoutN=IoutN IoutP=IoutP IoutS=IoutS RP_GATE_DRV=RP_GATE_DRV TemP=TemP VoutN=VoutN VoutP=VoutP VoutS=VoutS
MAIN SHEET/Ch4: designators C1=C1_Ch4 C2=C2_Ch4 C3=C3_Ch4 C4=C4_Ch4 C5=C5_Ch4 C6=C6_Ch4 C7=C7_Ch4 C8=C8_Ch4 C9=C9_Ch4 C10=C10_Ch4 C11=C11_Ch4 C12=C12_Ch4 C13=C13_Ch4 C14=C14_Ch4 C15=C15_Ch4 C16=C16_Ch4 C17=C17_Ch4 C18=C18_Ch4 C19=C19_Ch4 C20=C20_Ch4 C21=C21_Ch4 C22=C22_Ch4 C23=C23_Ch4 C24=C24_Ch4 C25=C25_Ch4 C26=C26_Ch4 C27=C27_Ch4 C28=C28_Ch4 C29=C29_Ch4 C31=C31_Ch4 C33=C33_Ch4 C35=C35_Ch4 C36=C36_Ch4 C37=C37_Ch4 C38=C38_Ch4 C39=C39_Ch4 C40=C40_Ch4 C45=C45_Ch4 C48=C48_Ch4 C49=C49_Ch4 C50=C50_Ch4 C52=C52_Ch4 C53=C53_Ch4 C54=C54_Ch4 C147=C147_Ch4 C151=C151_Ch4 C166=C166_Ch4 C167=C167_Ch4 C168=C168_Ch4 C170=C170_Ch4 C171=C171_Ch4 C172=C172_Ch4 C174=C174_Ch4 C177=C177_Ch4 C178=C178_Ch4 C179=C179_Ch4 C180=C180_Ch4 C181=C181_Ch4 C182=C182_Ch4 C183=C183_Ch4 C184=C184_Ch4 C185=C185_Ch4 D1=D1_Ch4 D2=D2_Ch4 D3=D3_Ch4 D4=D4_Ch4 D34=D34_Ch4 D35=D35_Ch4 D36=D36_Ch4 F1=F1_Ch4 J1=J1_Ch4 J2=J2_Ch4 J3=J3_Ch4 L1=L1_Ch4 L2=L2_Ch4 Q1=Q1_Ch4 Q7=Q7_Ch4 Q8=Q8_Ch4 R1=R1_Ch4 R2=R2_Ch4 R3=R3_Ch4 R4=R4_Ch4 R5=R5_Ch4 R6=R6_Ch4 R7=R7_Ch4 R8=R8_Ch4 R9=R9_Ch4 R10=R10_Ch4 R11=R11_Ch4 R12=R12_Ch4 R13=R13_Ch4 R14=R14_Ch4 R15=R15_Ch4 R16=R16_Ch4 R17=R17_Ch4 R18=R18_Ch4 R19=R19_Ch4 R20=R20_Ch4 R21=R21_Ch4 R24=R24_Ch4 R25=R25_Ch4 R28=R28_Ch4 R29=R29_Ch4 R30=R30_Ch4 R31=R31_Ch4 R32=R32_Ch4 R33=R33_Ch4 R34=R34_Ch4 R35=R35_Ch4 R36=R36_Ch4 R37=R37_Ch4 R38=R38_Ch4 R39=R39_Ch4 R40=R40_Ch4 R44=R44_Ch4 R45=R45_Ch4 R46=R46_Ch4 R61=R61_Ch4 R62=R62_Ch4 R63=R63_Ch4 R64=R64_Ch4 R65=R65_Ch4 R66=R66_Ch4 R67=R67_Ch4 R68=R68_Ch4 R69=R69_Ch4 R70=R70_Ch4 R71=R71_Ch4 R72=R72_Ch4 R73=R73_Ch4 R74=R74_Ch4 R75=R75_Ch4 R76=R76_Ch4 R77=R77_Ch4 R161=R161_Ch4 R185=R185_Ch4 R216=R216_Ch4 R217=R217_Ch4 R219=R219_Ch4 R221=R221_Ch4 R287=R287_Ch4 R290=R290_Ch4 R291=R291_Ch4 R302=R302_Ch4 R336=R336_Ch4 R337=R337_Ch4 RT1=RT1_Ch4#2 RT1=RT1_Ch4#1 TP1=TP1_Ch4 TP2=TP2_Ch4 TP3=TP3_Ch4 TP4=TP4_Ch4 TP5=TP5_Ch4 TP6=TP6_Ch4 TP7=TP7_Ch4 TP8=TP8_Ch4 TP9=TP9_Ch4 TP10=TP10_Ch4 TP42=TP42_Ch4 TP43=TP43_Ch4 TP44=TP44_Ch4 U1=U1_Ch4 U2=U2_Ch4 U3=U3_Ch4 U4=U4_Ch4 U5=U5_Ch4 U6=U6_Ch4 U10=U10_Ch4 U36=U36_Ch4 U37=U37_Ch4 U40=U40_Ch4; ports EPWM_A=EPWM_A EPWM_B=EPWM_B IoutN=IoutN IoutP=IoutP IoutS=IoutS RP_GATE_DRV=RP_GATE_DRV TemP=TemP VoutN=VoutN VoutP=VoutP VoutS=VoutS
MAIN SHEET/Ch5: designators C1=C1_Ch5 C2=C2_Ch5 C3=C3_Ch5 C4=C4_Ch5 C5=C5_Ch5 C6=C6_Ch5 C7=C7_Ch5 C8=C8_Ch5 C9=C9_Ch5 C10=C10_Ch5 C11=C11_Ch5 C12=C12_Ch5 C13=C13_Ch5 C14=C14_Ch5 C15=C15_Ch5 C16=C16_Ch5 C17=C17_Ch5 C18=C18_Ch5 C19=C19_Ch5 C20=C20_Ch5 C21=C21_Ch5 C22=C22_Ch5 C23=C23_Ch5 C24=C24_Ch5 C25=C25_Ch5 C26=C26_Ch5 C27=C27_Ch5 C28=C28_Ch5 C29=C29_Ch5 C31=C31_Ch5 C33=C33_Ch5 C35=C35_Ch5 C36=C36_Ch5 C37=C37_Ch5 C38=C38_Ch5 C39=C39_Ch5 C40=C40_Ch5 C45=C45_Ch5 C48=C48_Ch5 C49=C49_Ch5 C50=C50_Ch5 C52=C52_Ch5 C53=C53_Ch5 C54=C54_Ch5 C147=C147_Ch5 C151=C151_Ch5 C166=C166_Ch5 C167=C167_Ch5 C168=C168_Ch5 C170=C170_Ch5 C171=C171_Ch5 C172=C172_Ch5 C174=C174_Ch5 C177=C177_Ch5 C178=C178_Ch5 C179=C179_Ch5 C180=C180_Ch5 C181=C181_Ch5 C182=C182_Ch5 C183=C183_Ch5 C184=C184_Ch5 C185=C185_Ch5 D1=D1_Ch5 D2=D2_Ch5 D3=D3_Ch5 D4=D4_Ch5 D34=D34_Ch5 D35=D35_Ch5 D36=D36_Ch5 F1=F1_Ch5 J1=J1_Ch5 J2=J2_Ch5 J3=J3_Ch5 L1=L1_Ch5 L2=L2_Ch5 Q1=Q1_Ch5 Q7=Q7_Ch5 Q8=Q8_Ch5 R1=R1_Ch5 R2=R2_Ch5 R3=R3_Ch5 R4=R4_Ch5 R5=R5_Ch5 R6=R6_Ch5 R7=R7_Ch5 R8=R8_Ch5 R9=R9_Ch5 R10=R10_Ch5 R11=R11_Ch5 R12=R12_Ch5 R13=R13_Ch5 R14=R14_Ch5 R15=R15_Ch5 R16=R16_Ch5 R17=R17_Ch5 R18=R18_Ch5 R19=R19_Ch5 R20=R20_Ch5 R21=R21_Ch5 R24=R24_Ch5 R25=R25_Ch5 R28=R28_Ch5 R29=R29_Ch5 R30=R30_Ch5 R31=R31_Ch5 R32=R32_Ch5 R33=R33_Ch5 R34=R34_Ch5 R35=R35_Ch5 R36=R36_Ch5 R37=R37_Ch5 R38=R38_Ch5 R39=R39_Ch5 R40=R40_Ch5 R44=R44_Ch5 R45=R45_Ch5 R46=R46_Ch5 R61=R61_Ch5 R62=R62_Ch5 R63=R63_Ch5 R64=R64_Ch5 R65=R65_Ch5 R66=R66_Ch5 R67=R67_Ch5 R68=R68_Ch5 R69=R69_Ch5 R70=R70_Ch5 R71=R71_Ch5 R72=R72_Ch5 R73=R73_Ch5 R74=R74_Ch5 R75=R75_Ch5 R76=R76_Ch5 R77=R77_Ch5 R161=R161_Ch5 R185=R185_Ch5 R216=R216_Ch5 R217=R217_Ch5 R219=R219_Ch5 R221=R221_Ch5 R287=R287_Ch5 R290=R290_Ch5 R291=R291_Ch5 R302=R302_Ch5 R336=R336_Ch5 R337=R337_Ch5 RT1=RT1_Ch5#2 RT1=RT1_Ch5#1 TP1=TP1_Ch5 TP2=TP2_Ch5 TP3=TP3_Ch5 TP4=TP4_Ch5 TP5=TP5_Ch5 TP6=TP6_Ch5 TP7=TP7_Ch5 TP8=TP8_Ch5 TP9=TP9_Ch5 TP10=TP10_Ch5 TP42=TP42_Ch5 TP43=TP43_Ch5 TP44=TP44_Ch5 U1=U1_Ch5 U2=U2_Ch5 U3=U3_Ch5 U4=U4_Ch5 U5=U5_Ch5 U6=U6_Ch5 U10=U10_Ch5 U36=U36_Ch5 U37=U37_Ch5 U40=U40_Ch5; ports EPWM_A=EPWM_A EPWM_B=EPWM_B IoutN=IoutN IoutP=IoutP IoutS=IoutS RP_GATE_DRV=RP_GATE_DRV TemP=TemP VoutN=VoutN VoutP=VoutP VoutS=VoutS
MAIN SHEET/Ch6: designators C1=C1_Ch6 C2=C2_Ch6 C3=C3_Ch6 C4=C4_Ch6 C5=C5_Ch6 C6=C6_Ch6 C7=C7_Ch6 C8=C8_Ch6 C9=C9_Ch6 C10=C10_Ch6 C11=C11_Ch6 C12=C12_Ch6 C13=C13_Ch6 C14=C14_Ch6 C15=C15_Ch6 C16=C16_Ch6 C17=C17_Ch6 C18=C18_Ch6 C19=C19_Ch6 C20=C20_Ch6 C21=C21_Ch6 C22=C22_Ch6 C23=C23_Ch6 C24=C24_Ch6 C25=C25_Ch6 C26=C26_Ch6 C27=C27_Ch6 C28=C28_Ch6 C29=C29_Ch6 C31=C31_Ch6 C33=C33_Ch6 C35=C35_Ch6 C36=C36_Ch6 C37=C37_Ch6 C38=C38_Ch6 C39=C39_Ch6 C40=C40_Ch6 C45=C45_Ch6 C48=C48_Ch6 C49=C49_Ch6 C50=C50_Ch6 C52=C52_Ch6 C53=C53_Ch6 C54=C54_Ch6 C147=C147_Ch6 C151=C151_Ch6 C166=C166_Ch6 C167=C167_Ch6 C168=C168_Ch6 C170=C170_Ch6 C171=C171_Ch6 C172=C172_Ch6 C174=C174_Ch6 C177=C177_Ch6 C178=C178_Ch6 C179=C179_Ch6 C180=C180_Ch6 C181=C181_Ch6 C182=C182_Ch6 C183=C183_Ch6 C184=C184_Ch6 C185=C185_Ch6 D1=D1_Ch6 D2=D2_Ch6 D3=D3_Ch6 D4=D4_Ch6 D34=D34_Ch6 D35=D35_Ch6 D36=D36_Ch6 F1=F1_Ch6 J1=J1_Ch6 J2=J2_Ch6 J3=J3_Ch6 L1=L1_Ch6 L2=L2_Ch6 Q1=Q1_Ch6 Q7=Q7_Ch6 Q8=Q8_Ch6 R1=R1_Ch6 R2=R2_Ch6 R3=R3_Ch6 R4=R4_Ch6 R5=R5_Ch6 R6=R6_Ch6 R7=R7_Ch6 R8=R8_Ch6 R9=R9_Ch6 R10=R10_Ch6 R11=R11_Ch6 R12=R12_Ch6 R13=R13_Ch6 R14=R14_Ch6 R15=R15_Ch6 R16=R16_Ch6 R17=R17_Ch6 R18=R18_Ch6 R19=R19_Ch6 R20=R20_Ch6 R21=R21_Ch6 R24=R24_Ch6 R25=R25_Ch6 R28=R28_Ch6 R29=R29_Ch6 R30=R30_Ch6 R31=R31_Ch6 R32=R32_Ch6 R33=R33_Ch6 R34=R34_Ch6 R35=R35_Ch6 R36=R36_Ch6 R37=R37_Ch6 R38=R38_Ch6 R39=R39_Ch6 R40=R40_Ch6 R44=R44_Ch6 R45=R45_Ch6 R46=R46_Ch6 R61=R61_Ch6 R62=R62_Ch6 R63=R63_Ch6 R64=R64_Ch6 R65=R65_Ch6 R66=R66_Ch6 R67=R67_Ch6 R68=R68_Ch6 R69=R69_Ch6 R70=R70_Ch6 R71=R71_Ch6 R72=R72_Ch6 R73=R73_Ch6 R74=R74_Ch6 R75=R75_Ch6 R76=R76_Ch6 R77=R77_Ch6 R161=R161_Ch6 R185=R185_Ch6 R216=R216_Ch6 R217=R217_Ch6 R219=R219_Ch6 R221=R221_Ch6 R287=R287_Ch6 R290=R290_Ch6 R291=R291_Ch6 R302=R302_Ch6 R336=R336_Ch6 R337=R337_Ch6 RT1=RT1_Ch6#2 RT1=RT1_Ch6#1 TP1=TP1_Ch6 TP2=TP2_Ch6 TP3=TP3_Ch6 TP4=TP4_Ch6 TP5=TP5_Ch6 TP6=TP6_Ch6 TP7=TP7_Ch6 TP8=TP8_Ch6 TP9=TP9_Ch6 TP10=TP10_Ch6 TP42=TP42_Ch6 TP43=TP43_Ch6 TP44=TP44_Ch6 U1=U1_Ch6 U2=U2_Ch6 U3=U3_Ch6 U4=U4_Ch6 U5=U5_Ch6 U6=U6_Ch6 U10=U10_Ch6 U36=U36_Ch6 U37=U37_Ch6 U40=U40_Ch6; ports EPWM_A=EPWM_A EPWM_B=EPWM_B IoutN=IoutN IoutP=IoutP IoutS=IoutS RP_GATE_DRV=RP_GATE_DRV TemP=TemP VoutN=VoutN VoutP=VoutP VoutS=VoutS
MAIN SHEET/Ch7: designators C1=C1_Ch7 C2=C2_Ch7 C3=C3_Ch7 C4=C4_Ch7 C5=C5_Ch7 C6=C6_Ch7 C7=C7_Ch7 C8=C8_Ch7 C9=C9_Ch7 C10=C10_Ch7 C11=C11_Ch7 C12=C12_Ch7 C13=C13_Ch7 C14=C14_Ch7 C15=C15_Ch7 C16=C16_Ch7 C17=C17_Ch7 C18=C18_Ch7 C19=C19_Ch7 C20=C20_Ch7 C21=C21_Ch7 C22=C22_Ch7 C23=C23_Ch7 C24=C24_Ch7 C25=C25_Ch7 C26=C26_Ch7 C27=C27_Ch7 C28=C28_Ch7 C29=C29_Ch7 C31=C31_Ch7 C33=C33_Ch7 C35=C35_Ch7 C36=C36_Ch7 C37=C37_Ch7 C38=C38_Ch7 C39=C39_Ch7 C40=C40_Ch7 C45=C45_Ch7 C48=C48_Ch7 C49=C49_Ch7 C50=C50_Ch7 C52=C52_Ch7 C53=C53_Ch7 C54=C54_Ch7 C147=C147_Ch7 C151=C151_Ch7 C166=C166_Ch7 C167=C167_Ch7 C168=C168_Ch7 C170=C170_Ch7 C171=C171_Ch7 C172=C172_Ch7 C174=C174_Ch7 C177=C177_Ch7 C178=C178_Ch7 C179=C179_Ch7 C180=C180_Ch7 C181=C181_Ch7 C182=C182_Ch7 C183=C183_Ch7 C184=C184_Ch7 C185=C185_Ch7 D1=D1_Ch7 D2=D2_Ch7 D3=D3_Ch7 D4=D4_Ch7 D34=D34_Ch7 D35=D35_Ch7 D36=D36_Ch7 F1=F1_Ch7 J1=J1_Ch7 J2=J2_Ch7 J3=J3_Ch7 L1=L1_Ch7 L2=L2_Ch7 Q1=Q1_Ch7 Q7=Q7_Ch7 Q8=Q8_Ch7 R1=R1_Ch7 R2=R2_Ch7 R3=R3_Ch7 R4=R4_Ch7 R5=R5_Ch7 R6=R6_Ch7 R7=R7_Ch7 R8=R8_Ch7 R9=R9_Ch7 R10=R10_Ch7 R11=R11_Ch7 R12=R12_Ch7 R13=R13_Ch7 R14=R14_Ch7 R15=R15_Ch7 R16=R16_Ch7 R17=R17_Ch7 R18=R18_Ch7 R19=R19_Ch7 R20=R20_Ch7 R21=R21_Ch7 R24=R24_Ch7 R25=R25_Ch7 R28=R28_Ch7 R29=R29_Ch7 R30=R30_Ch7 R31=R31_Ch7 R32=R32_Ch7 R33=R33_Ch7 R34=R34_Ch7 R35=R35_Ch7 R36=R36_Ch7 R37=R37_Ch7 R38=R38_Ch7 R39=R39_Ch7 R40=R40_Ch7 R44=R44_Ch7 R45=R45_Ch7 R46=R46_Ch7 R61=R61_Ch7 R62=R62_Ch7 R63=R63_Ch7 R64=R64_Ch7 R65=R65_Ch7 R66=R66_Ch7 R67=R67_Ch7 R68=R68_Ch7 R69=R69_Ch7 R70=R70_Ch7 R71=R71_Ch7 R72=R72_Ch7 R73=R73_Ch7 R74=R74_Ch7 R75=R75_Ch7 R76=R76_Ch7 R77=R77_Ch7 R161=R161_Ch7 R185=R185_Ch7 R216=R216_Ch7 R217=R217_Ch7 R219=R219_Ch7 R221=R221_Ch7 R287=R287_Ch7 R290=R290_Ch7 R291=R291_Ch7 R302=R302_Ch7 R336=R336_Ch7 R337=R337_Ch7 RT1=RT1_Ch7#2 RT1=RT1_Ch7#1 TP1=TP1_Ch7 TP2=TP2_Ch7 TP3=TP3_Ch7 TP4=TP4_Ch7 TP5=TP5_Ch7 TP6=TP6_Ch7 TP7=TP7_Ch7 TP8=TP8_Ch7 TP9=TP9_Ch7 TP10=TP10_Ch7 TP42=TP42_Ch7 TP43=TP43_Ch7 TP44=TP44_Ch7 U1=U1_Ch7 U2=U2_Ch7 U3=U3_Ch7 U4=U4_Ch7 U5=U5_Ch7 U6=U6_Ch7 U10=U10_Ch7 U36=U36_Ch7 U37=U37_Ch7 U40=U40_Ch7; ports EPWM_A=EPWM_A EPWM_B=EPWM_B IoutN=IoutN IoutP=IoutP IoutS=IoutS RP_GATE_DRV=RP_GATE_DRV TemP=TemP VoutN=VoutN VoutP=VoutP VoutS=VoutS
MAIN SHEET/Ch8: designators C1=C1_Ch8 C2=C2_Ch8 C3=C3_Ch8 C4=C4_Ch8 C5=C5_Ch8 C6=C6_Ch8 C7=C7_Ch8 C8=C8_Ch8 C9=C9_Ch8 C10=C10_Ch8 C11=C11_Ch8 C12=C12_Ch8 C13=C13_Ch8 C14=C14_Ch8 C15=C15_Ch8 C16=C16_Ch8 C17=C17_Ch8 C18=C18_Ch8 C19=C19_Ch8 C20=C20_Ch8 C21=C21_Ch8 C22=C22_Ch8 C23=C23_Ch8 C24=C24_Ch8 C25=C25_Ch8 C26=C26_Ch8 C27=C27_Ch8 C28=C28_Ch8 C29=C29_Ch8 C31=C31_Ch8 C33=C33_Ch8 C35=C35_Ch8 C36=C36_Ch8 C37=C37_Ch8 C38=C38_Ch8 C39=C39_Ch8 C40=C40_Ch8 C45=C45_Ch8 C48=C48_Ch8 C49=C49_Ch8 C50=C50_Ch8 C52=C52_Ch8 C53=C53_Ch8 C54=C54_Ch8 C147=C147_Ch8 C151=C151_Ch8 C166=C166_Ch8 C167=C167_Ch8 C168=C168_Ch8 C170=C170_Ch8 C171=C171_Ch8 C172=C172_Ch8 C174=C174_Ch8 C177=C177_Ch8 C178=C178_Ch8 C179=C179_Ch8 C180=C180_Ch8 C181=C181_Ch8 C182=C182_Ch8 C183=C183_Ch8 C184=C184_Ch8 C185=C185_Ch8 D1=D1_Ch8 D2=D2_Ch8 D3=D3_Ch8 D4=D4_Ch8 D34=D34_Ch8 D35=D35_Ch8 D36=D36_Ch8 F1=F1_Ch8 J1=J1_Ch8 J2=J2_Ch8 J3=J3_Ch8 L1=L1_Ch8 L2=L2_Ch8 Q1=Q1_Ch8 Q7=Q7_Ch8 Q8=Q8_Ch8 R1=R1_Ch8 R2=R2_Ch8 R3=R3_Ch8 R4=R4_Ch8 R5=R5_Ch8 R6=R6_Ch8 R7=R7_Ch8 R8=R8_Ch8 R9=R9_Ch8 R10=R10_Ch8 R11=R11_Ch8 R12=R12_Ch8 R13=R13_Ch8 R14=R14_Ch8 R15=R15_Ch8 R16=R16_Ch8 R17=R17_Ch8 R18=R18_Ch8 R19=R19_Ch8 R20=R20_Ch8 R21=R21_Ch8 R24=R24_Ch8 R25=R25_Ch8 R28=R28_Ch8 R29=R29_Ch8 R30=R30_Ch8 R31=R31_Ch8 R32=R32_Ch8 R33=R33_Ch8 R34=R34_Ch8 R35=R35_Ch8 R36=R36_Ch8 R37=R37_Ch8 R38=R38_Ch8 R39=R39_Ch8 R40=R40_Ch8 R44=R44_Ch8 R45=R45_Ch8 R46=R46_Ch8 R61=R61_Ch8 R62=R62_Ch8 R63=R63_Ch8 R64=R64_Ch8 R65=R65_Ch8 R66=R66_Ch8 R67=R67_Ch8 R68=R68_Ch8 R69=R69_Ch8 R70=R70_Ch8 R71=R71_Ch8 R72=R72_Ch8 R73=R73_Ch8 R74=R74_Ch8 R75=R75_Ch8 R76=R76_Ch8 R77=R77_Ch8 R161=R161_Ch8 R185=R185_Ch8 R216=R216_Ch8 R217=R217_Ch8 R219=R219_Ch8 R221=R221_Ch8 R287=R287_Ch8 R290=R290_Ch8 R291=R291_Ch8 R302=R302_Ch8 R336=R336_Ch8 R337=R337_Ch8 RT1=RT1_Ch8#2 RT1=RT1_Ch8#1 TP1=TP1_Ch8 TP2=TP2_Ch8 TP3=TP3_Ch8 TP4=TP4_Ch8 TP5=TP5_Ch8 TP6=TP6_Ch8 TP7=TP7_Ch8 TP8=TP8_Ch8 TP9=TP9_Ch8 TP10=TP10_Ch8 TP42=TP42_Ch8 TP43=TP43_Ch8 TP44=TP44_Ch8 U1=U1_Ch8 U2=U2_Ch8 U3=U3_Ch8 U4=U4_Ch8 U5=U5_Ch8 U6=U6_Ch8 U10=U10_Ch8 U36=U36_Ch8 U37=U37_Ch8 U40=U40_Ch8; ports EPWM_A=EPWM_A EPWM_B=EPWM_B IoutN=IoutN IoutP=IoutP IoutS=IoutS RP_GATE_DRV=RP_GATE_DRV TemP=TemP VoutN=VoutN VoutP=VoutP VoutS=VoutS

### Layout directives
net class PS: 12V_Out, +VSense, -VSense, B+, B-, CS+, CS-, HDrive, LDrive, PDrive, PGND, SW, V+, V-
net class DRV: 10V_Gate, H-Drive, HDrive, L-Drive, LDrive, PGND, SW
net class RV; Group: RV: 10V, -5V, B+, PDrive, PGND, V+
net class TS; Group: TS: AGND, AVDD, Vbias_1_25, Vref_2_50
net class ACS: 10V, -5V, AGND, AVDD, B+, B-
net class CS: 10V, -5V, AGND, AVDD, CS+, CS-, IoutN, IoutP, IoutS, Vbias_1_25